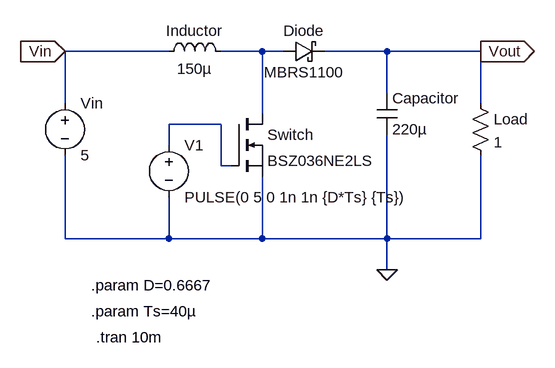
[diagram p0: schematic boost_converter2.asc]
boost_converter2.asc, the LTspice schematic file:
Version 4
SHEET 1 880 680
WIRE -80 48 -240 48
WIRE 64 48 0 48
WIRE 96 48 64 48
WIRE 256 48 160 48
WIRE 400 48 256 48
WIRE 256 112 256 48
WIRE -240 128 -240 48
WIRE 400 128 400 48
WIRE 64 144 64 48
WIRE 0 160 -80 160
WIRE -80 192 -80 160
WIRE 0 224 0 160
WIRE 16 224 0 224
WIRE -240 336 -240 208
WIRE -80 336 -80 272
WIRE -80 336 -240 336
WIRE 64 336 64 240
WIRE 64 336 -80 336
WIRE 256 336 256 176
WIRE 256 336 64 336
WIRE 400 336 400 208
WIRE 400 336 256 336
WIRE 256 384 256 336
FLAG 256 384 0
FLAG -240 48 Vin
IOPIN -240 48 In
FLAG 400 48 Vout
IOPIN 400 48 Out
SYMBOL cap 240 112 R0
SYMATTR InstName Capacitor
SYMATTR Value 220µ
SYMBOL res 384 112 R0
SYMATTR InstName Load
SYMATTR Value 1
SYMBOL schottky 96 64 R270
WINDOW 0 32 32 VTop 2
WINDOW 3 0 32 VBottom 2
SYMATTR InstName Diode
SYMATTR Value MBRS1100
SYMATTR Description Diode
SYMATTR Type diode
SYMBOL ind -96 64 R270
WINDOW 0 32 56 VTop 2
WINDOW 3 5 56 VBottom 2
SYMATTR InstName Inductor
SYMATTR Value 150µ
SYMATTR SpiceLine Rser=10m
SYMBOL nmos 16 144 R0
SYMATTR InstName Switch
SYMATTR Value BSZ036NE2LS
SYMBOL voltage -80 176 R0
WINDOW 123 0 0 Left 0
WINDOW 39 0 0 Left 0
SYMATTR InstName V1
SYMATTR Value PULSE(0 5 0 1n 1n {D*Ts} {Ts})
SYMBOL voltage -240 112 R0
WINDOW 123 0 0 Left 0
WINDOW 39 0 0 Left 0
SYMATTR InstName Vin
SYMATTR Value 5
TEXT -200 408 Left 2 !.param D=0.6667
TEXT -200 448 Left 2 !.param Ts=40µ
TEXT -192 488 Left 2 !.tran 10m

The netlist it stands for:
* boost_converter2.asc
Capacitor Vout 0 220µ
R§Load Vout 0 1
Diode N001 Vout MBRS1100
L§Inductor Vin N001 150µ Rser=10m
M§Switch N001 N002 0 0 BSZ036NE2LS
V1 N002 0 PULSE(0 5 0 1n 1n {D*Ts} {Ts})
Vin Vin 0 5
.model D D
.lib standard.dio
.model NMOS NMOS
.model PMOS PMOS
.lib standard.mos
.param D=0.6667
.param Ts=40µ
.tran 10m
.backanno
.end